# EAGLE design ESP32-S3 Parallel TFT with Touch 4.3“ V1.3 (EAGLE 6.1)
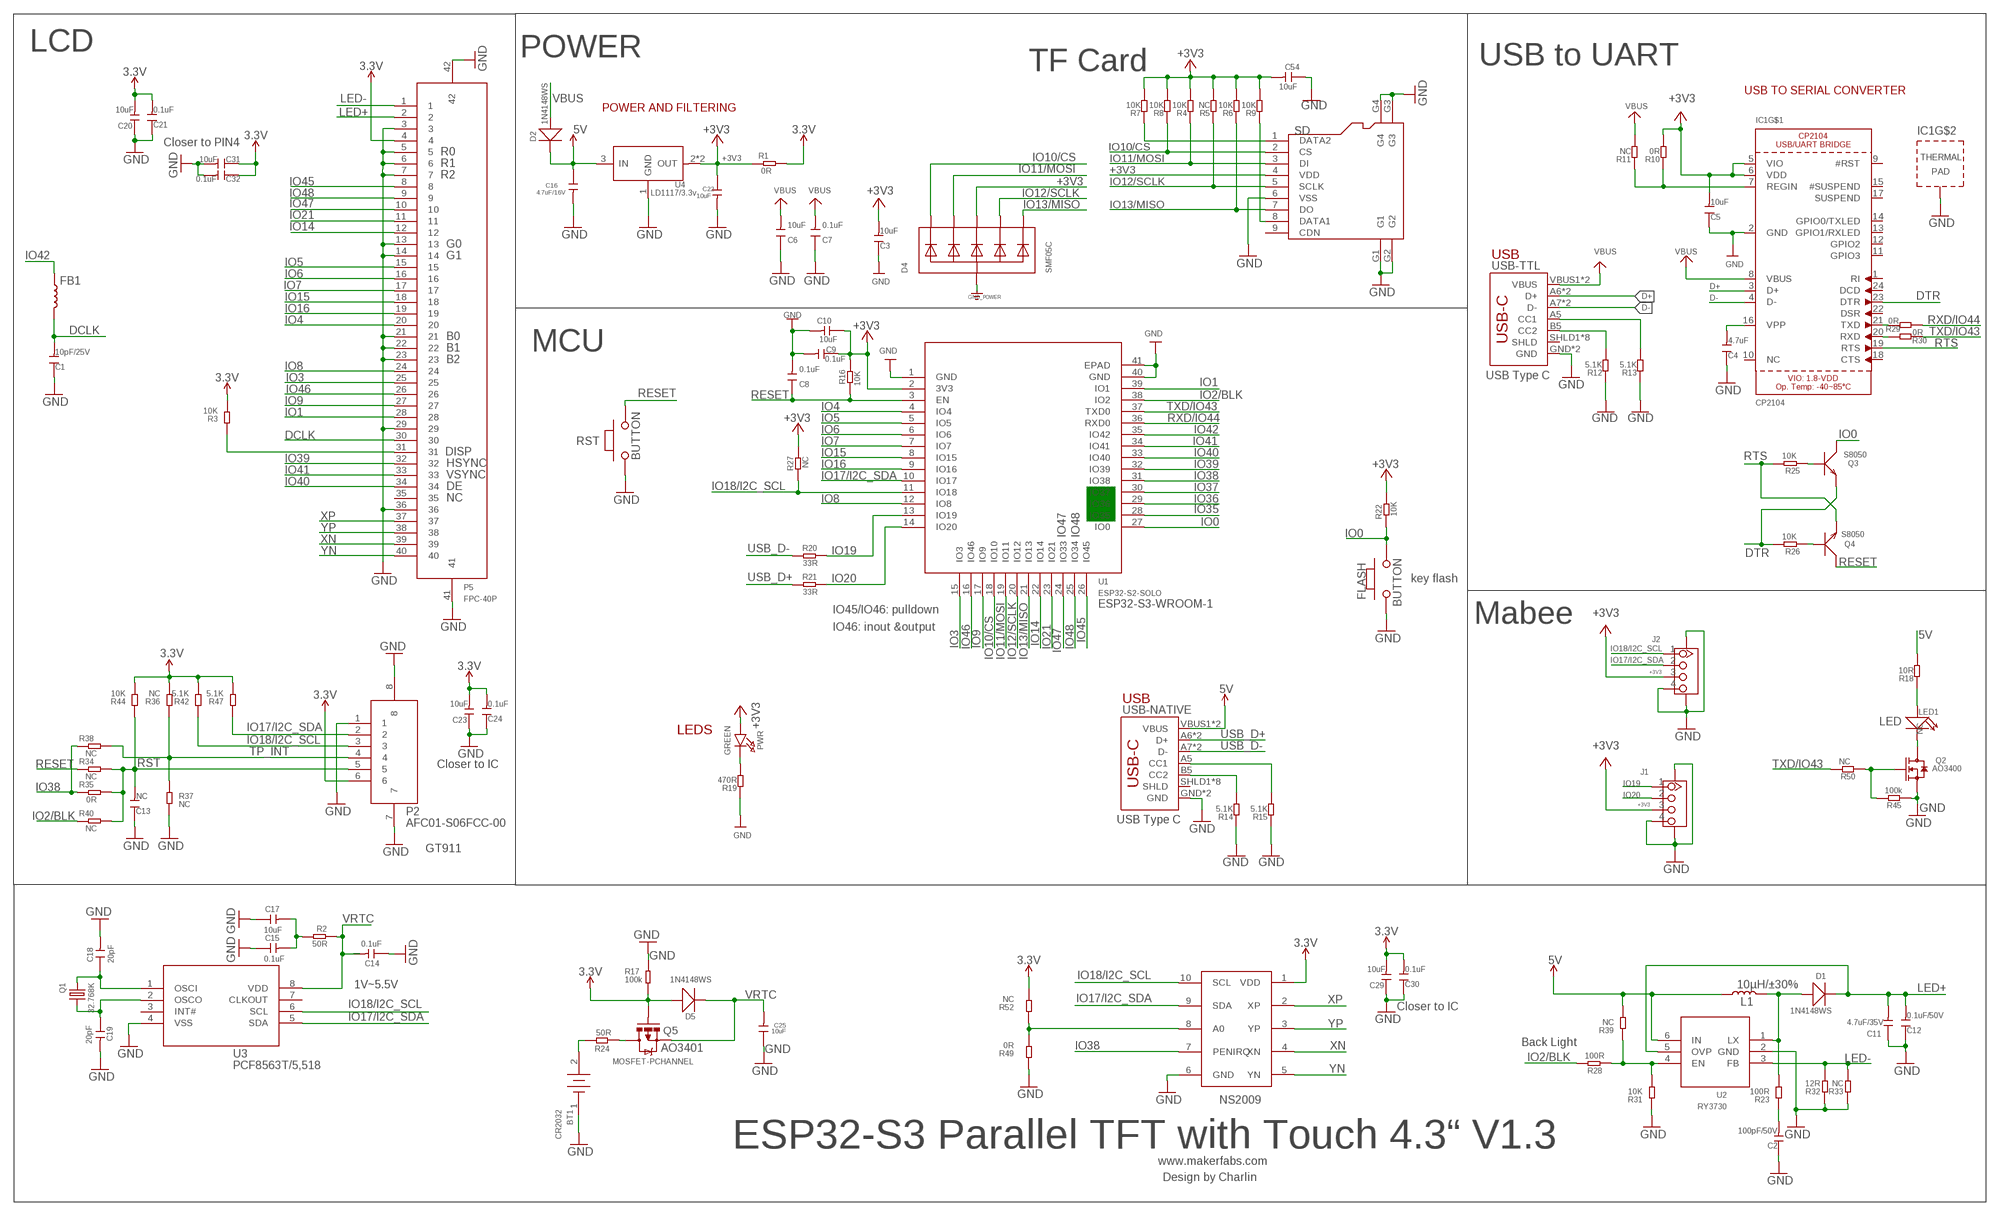
[diagram p0: schematic, sheet 1]

## Parts
BT1  CR2032  [CR2032]
C1  10pF/25V  DISCRETE_C-0603  [DISCRETE_C0603]
C2  100pF/50V  DISCRETE_C-0603  [DISCRETE_C0603]
C3  10uF  DISCRETE_C-0603  [DISCRETE_C0603]
C4  4.7uF  DISCRETE_C-0603  [DISCRETE_C0603]
C5  10uF  DISCRETE_C-0603  [DISCRETE_C0603]
C6  10uF  DISCRETE_C-0603  [DISCRETE_C0603]
C7  0.1uF  DISCRETE_C-0603  [DISCRETE_C0603]
C8  0.1uF  DISCRETE_C-0603  [DISCRETE_C0603]
C9  0.1uF  DISCRETE_C-0603  [DISCRETE_C0603]
C10  10uF  DISCRETE_C-0603  [DISCRETE_C0603]
C11  4.7uF/35V  DISCRETE_C-1206  [DISCRETE_C1206]
C12  0.1uF/50V  DISCRETE_C-0603  [DISCRETE_C0603]
C13  NC  DISCRETE_C-0603  [DISCRETE_C0603]
C14  0.1uF  DISCRETE_C-0603  [DISCRETE_C0603]
C15  0.1uF  DISCRETE_C-0603  [DISCRETE_C0603]
C16  4.7uF/16V  C-0603  [0603]
C17  10uF  DISCRETE_C-0603  [DISCRETE_C0603]
C18  20pF  DISCRETE_C-0603  [DISCRETE_C0603]
C19  20pF  DISCRETE_C-0603  [DISCRETE_C0603]
C20  10uF  DISCRETE_C-0603  [DISCRETE_C0603]
C21  0.1uF  DISCRETE_C-0603  [DISCRETE_C0603]
C22  10uF  C-0603  [0603]
C23  10uF  DISCRETE_C-0603  [DISCRETE_C0603]
C24  0.1uF  DISCRETE_C-0603  [DISCRETE_C0603]
C25  10uF  C-0603  [0603]
C29  10uF  DISCRETE_C-0603  [DISCRETE_C0603]
C30  0.1uF  DISCRETE_C-0603  [DISCRETE_C0603]
C31  10uF  DISCRETE_C-0603  [DISCRETE_C0603]
C32  0.1uF  DISCRETE_C-0603  [DISCRETE_C0603]
C54  10uF  DISCRETE_C-0603  [DISCRETE_C0603]
D1  1N4148WS  D'0805'  [SOD323]
D2  1N4148WS  D'0805'  [SOD323]
D4  SMF05C  TVSARRAY_5LANE  [SOT363]
D5  1N4148WS  D'0805'  [SOD323]
FB1  INDUCTORFB-30OHM  [0603]
FLASH  BUTTON  PB157  [157SW]
IC1  CP2104  [QFN24_4MM_SMSC]
J1  GROVE-CONNECTOR-SMD'90D'  [HW4-SMD-2.0-90D]
J2  GROVE-CONNECTOR-SMD'90D'  [HW4-SMD-2.0-90D]
L1  10µH/±30%  INDUCTOR-CR54-3.3UH  [CR54]
LED1  NC  DISCRETE_LED3528  [DISCRETE_LED-3528]
P2  AFC01-S06FCC-00  [SMD8-50P-740L535W]
P5  FPC-40P  [SMD42-50P-2560L490W]
PWR  GREEN  LED0805_NOOUTLINE  [CHIPLED_0805_NOOUTLINE]
Q1  32.768K  CRYSTAL_3215  [XTAL3215]
Q2  AO3400  MOSFET-N'SOT23'  [SOT23@1]
Q3  S8050  TRANSISTOR-NPN-SOT23  [SOT23]
Q4  S8050  TRANSISTOR-NPN-SOT23  [SOT23]
Q5  MOSFET-PCHANNEL  [SOT23-3]
R1  0R  R-0603  [R0603]
R2  50R  R-0603  [R0603]
R3  10K  DISCRETE_R-0603  [DISCRETE_R0603]
R4  10K  DISCRETE_R-0603  [DISCRETE_R0603]
R5  NC  DISCRETE_R-0603  [DISCRETE_R0603]
R6  10K  DISCRETE_R-0603  [DISCRETE_R0603]
R7  10K  DISCRETE_R-0603  [DISCRETE_R0603]
R8  10K  DISCRETE_R-0603  [DISCRETE_R0603]
R9  10K  DISCRETE_R-0603  [DISCRETE_R0603]
R10  0R  DISCRETE_R-0603  [DISCRETE_R0603]
R11  NC  DISCRETE_R-0603  [DISCRETE_R0603]
R12  5.1K  DISCRETE_R-0603  [DISCRETE_R0603]
R13  5.1K  DISCRETE_R-0603  [DISCRETE_R0603]
R14  5.1K  DISCRETE_R-0603  [DISCRETE_R0603]
R15  5.1K  DISCRETE_R-0603  [DISCRETE_R0603]
R16  10K  R-0603  [R0603]
R17  100k  R-0603  [R0603]
R18  10R  DISCRETE_R-0603  [DISCRETE_R0603]
R19  470R  DISCRETE_R-0603  [DISCRETE_R0603]
R20  33R  R-0603  [R0603]
R21  33R  R-0603  [R0603]
R22  10K  R-0603  [R0603]
R23  100R  DISCRETE_R-0603  [DISCRETE_R0603]
R24  50R  R-0603  [R0603]
R25  10K  R-0603  [R0603]
R26  10K  R-0603  [R0603]
R27  NC  R-0603  [R0603]
R28  100R  DISCRETE_R-0603  [DISCRETE_R0603]
R29  0R  R-0603  [R0603]
R30  0R  R-0603  [R0603]
R31  10K  DISCRETE_R-0603  [DISCRETE_R0603]
R32  12R  DISCRETE_R-0603  [DISCRETE_R0603]
R33  NC  DISCRETE_R-0603  [DISCRETE_R0603]
R34  NC  R-0603  [R0603]
R35  0R  R-0603  [R0603]
R36  NC  DISCRETE_R-0603  [DISCRETE_R0603]
R37  NC  DISCRETE_R-0603  [DISCRETE_R0603]
R38  NC  R-0603  [R0603]
R39  NC  DISCRETE_R-0603  [DISCRETE_R0603]
R40  NC  R-0603  [R0603]
R42  5.1K  DISCRETE_R-0603  [DISCRETE_R0603]
R44  10K  DISCRETE_R-0603  [DISCRETE_R0603]
R45  100k  R-0603  [R0603]
R47  5.1K  DISCRETE_R-0603  [DISCRETE_R0603]
R49  0R  DISCRETE_R-0603  [DISCRETE_R0603]
R50  NC  R-0603  [R0603]
R52  NC  DISCRETE_R-0603  [DISCRETE_R0603]
RST  BUTTON  PB157  [157SW]
SD  HOLDER-MICROSD-9P  [9P-SMD-W/-RING]
U1  ESP32­S2­SOLO  [ESP32-­S2-­SOLO]
U2  RY3730  [SOT23-6]
U3  PCF8563T/5,518  [SOP8]
U4  LD1117/3.3v  LD1117'SOT89'  [SOT89]
U8  NS2009  [MSOP10]
USB-NATIVE  USB_C5  [USB-C-16P-5]
USB-TTL  USB_C5  [USB-C-16P-5]

## Nets
3.3V: C20.2 C21.2 C23.2 C24.2 C29.2 C30.2 C31.1 C32.1 D5.+ P2.6 P5.4 Q5.1(G) R1.2 R3.2 R17.1 R36.2 R42.2 R44.2 R47.2 R52.2 U8.1(VDD)
5V: C16.1 D2.- L1.P$1 R18.2 R39.2 U2.6(IN) U4.3(IN) USB-NATIVE.VBUS1(VBUS) USB-NATIVE.VBUS2(VBUS)
+3V3: C3.2 C5.2 C9.1 C10.1 C22.1 C54.2 D4.4(C3) IC1.5(VIO) IC1.6(VDD) J1.3 J2.3 PWR.A R1.1 R4.2 R5.2 R6.2 R7.2 R8.2 R9.2 R10.2 R16.2 R22.2 R27.2 SD.4(VDD) U1.2(3V3) U4.2(OUT) U4.4(OUT)
D+: IC1.3(D+) USB-TTL.A6(D+) USB-TTL.B6(D+)
D-: IC1.4(D-) USB-TTL.A7(D-) USB-TTL.B7(D-)
DCLK: C1.2 FB1.2 P5.30
DTR: IC1.23(DTR) Q3.2(E) R26.2
GND: BT1.1 C1.1 C2.1 C3.1 C4.1 C5.1 C6.1 C7.1 C8.2 C9.2 C10.2 C11.1 C12.1 C13.1 C14.1 C15.1 C16.2 C17.1 C18.2 C19.2 C20.1 C21.1 C22.2 C23.1 C24.1 C25.1 C29.1 C30.1 C31.2 C32.2 C54.1 D4.2(A) FLASH.1 IC1.2(GND) IC1.THERM(TP) J1.4 J1.SS1 J1.SS2 J2.4 J2.SS1 J2.SS2 P2.1 P2.7 P2.8 P5.3 P5.5 P5.6 P5.7 P5.13 P5.14 P5.21 P5.22 P5.23 P5.29 P5.36 P5.41 P5.42 Q2.2(S) R12.1 R13.1 R14.1 R15.1 R17.2 R19.1 R31.1 R32.1 R33.1 R37.2 R45.1 R49.1 RST.1 SD.6(VSS) SD.G1 SD.G2 SD.G3 SD.G4 U1.1(GND) U1.40(GND) U1.41(EPAD) U2.2(GND) U3.4(VSS) U4.1(GND) U8.6(GND) USB-NATIVE.GND USB-NATIVE.GND2(GND) USB-TTL.GND USB-TTL.GND2(GND) ; supply symbol labelled GND_POWER
IO0: FLASH.2 Q3.3(C) R22.1 U1.27(IO0)
IO1: P5.28 U1.39(IO1)
IO2/BLK: R28.2 R40.1 U1.38(IO2)
IO3: P5.25 U1.15(IO3)
IO4: P5.20 U1.4(IO4)
IO5: P5.15 U1.5(IO5)
IO6: P5.16 U1.6(IO6)
IO7: P5.17 U1.7(IO7)
IO8: P5.24 U1.12(IO8)
IO9: P5.27 U1.17(IO9)
IO10/CS: D4.1(C1) R8.1 SD.2(CS) U1.18(IO10)
IO11/MOSI: D4.3(C2) R4.1 SD.3(DI) U1.19(IO11)
IO12/SCLK: D4.5(C4) R5.1 SD.5(SCLK) U1.20(IO12)
IO13/MISO: D4.6(C5) R6.1 SD.7(DO) U1.21(IO13)
IO14: P5.12 U1.22(IO14)
IO15: P5.18 U1.8(IO15)
IO16: P5.19 U1.9(IO16)
IO17/I2C_SDA: J2.2 P2.2 R47.1 U1.10(IO17) U3.5(SDA) U8.9(SDA)
IO18/I2C_SCL: J2.1 P2.3 R27.1 R42.1 U1.11(IO18) U3.6(SCL) U8.10(SCL)
IO19: J1.1 R20.2 U1.13(IO19)
IO20: J1.2 R21.2 U1.14(IO20)
IO21: P5.11 U1.23(IO21)
IO35: U1.28(IO35)
IO36: U1.29(IO36)
IO37: U1.30(IO37)
IO38: R35.1 R38.1 U1.31(IO38) U8.7(PENIRQ)
IO39: P5.32 U1.32(IO39)
IO40: P5.34 U1.33(IO40)
IO41: P5.33 U1.34(IO41)
IO42: FB1.1 U1.35(IO42)
IO45: P5.8 U1.26(IO45)
IO46: P5.26 U1.16(IO46)
IO47: P5.10 U1.24(IO33)
IO48: P5.9 U1.25(IO34)
LED+: C11.2 C12.2 D1.- P5.2 U2.5(OVP)
LED-: P5.1 R32.2 R33.2 U2.3(FB)
N$1: C4.2 IC1.16(VPP)
N$2: Q4.1(B) R26.1
N$3: Q3.1(B) R25.1
N$4: C18.1 Q1.P$1 U3.1(OSCI)
N$5: Q2.1(G) R45.2 R50.1
N$6: R15.2 USB-NATIVE.A5(CC1)
N$7: PWR.C R19.2
N$8: LED1.1(+) R18.1
N$9: LED1.2(-) Q2.3(D)
N$10: R13.2 USB-TTL.A5(CC1)
N$11: R12.2 USB-TTL.B5(CC2)
N$12: IC1.7(REGIN) R10.1 R11.1
N$13: C19.1 Q1.P$2 U3.2(OSCO)
N$14: R14.2 USB-NATIVE.B5(CC2)
N$15: Q5.3(D) R24.1
N$16: C15.2 C17.2 R2.1
N$17: D1.+ L1.P$2 R23.2 U2.1(LX)
N$18: IC1.21(TXD) R29.2
N$19: IC1.20(RXD) R30.2
N$20: BT1.2 R24.2
N$22: C2.2 R23.1
N$24: R28.1 R31.2 R39.1 U2.4(EN)
N$25: R49.2 R52.1 U8.8(A0)
N$28: P5.31 R3.1
N$47: R7.1 SD.1(DATA2)
N$48: R9.1 SD.8(DATA1)
RESET: C8.1 Q4.3(C) R16.1 R34.1 RST.2 U1.3(EN)
RST: C13.2 P2.5 R34.2 R35.2 R40.2 R44.1
RTS: IC1.19(RTS) Q4.2(E) R25.2
RXD/IO44: R29.1 U1.36(RXD0)
TP_INT: P2.4 R36.1 R37.1 R38.2
TXD/IO43: R30.1 R50.2 U1.37(TXD0)
USB_D+: R21.1 USB-NATIVE.A6(D+) USB-NATIVE.B6(D+)
USB_D-: R20.1 USB-NATIVE.A7(D-) USB-NATIVE.B7(D-)
VBUS: C6.2 C7.2 D2.+ IC1.8(VBUS) R11.2 USB-TTL.VBUS1(VBUS) USB-TTL.VBUS2(VBUS)
VRTC: C14.2 C25.2 D5.- Q5.2(S) R2.2 U3.8(VDD)
XN: P5.39 U8.4(XN)
XP: P5.37 U8.2(XP)
YN: P5.40 U8.5(YN)
YP: P5.38 U8.3(YP)
Unconnected: IC1.1(RI) IC1.9(#RST) IC1.10(NC) IC1.11(GPIO3) IC1.12(GPIO2) IC1.13(GPIO1/RXLED) IC1.14(GPIO0/TXLED) IC1.15(#SUSPEND) IC1.17(SUSPEND) IC1.18(CTS) IC1.22(DSR) IC1.24(DCD) P5.35 SD.9(CDN) U3.3(INT#) U3.7(CLKOUT) USB-NATIVE.SHLD1(SHLD) USB-NATIVE.SHLD2(SHLD) USB-NATIVE.SHLD3(SHLD) USB-NATIVE.SHLD4(SHLD) USB-NATIVE.SHLD5(SHLD) USB-NATIVE.SHLD6(SHLD) USB-NATIVE.SHLD7(SHLD) USB-NATIVE.SHLD8(SHLD) USB-TTL.SHLD1(SHLD) USB-TTL.SHLD2(SHLD) USB-TTL.SHLD3(SHLD) USB-TTL.SHLD4(SHLD) USB-TTL.SHLD5(SHLD) USB-TTL.SHLD6(SHLD) USB-TTL.SHLD7(SHLD) USB-TTL.SHLD8(SHLD)

## Notes on the sheet
- LCD | POWER
- TF Card | USB to UART
- USB TO SERIAL CONVERTER
- POWER AND FILTERING
- Closer to PIN4
- R0
- R1
- R2
- G0
- G1 | USB
- B0
- B1 | MCU
- B2
- USB Type C
- DISP
- HSYNC
- VSYNC
- DE
- NC
- IO47 | IO48
- key flash
- ESP32-S3-WROOM-1
- IO45/IO46: pulldown
- Mabee
- IO46: inout &output
- USB
- LED
- LEDS
- Closer to IC
- USB Type C
- GT911
- 1V~5.5V
- Closer to IC
- Back Light
- AO3401
- NS2009
- ESP32-S3 Parallel TFT with Touch 4.3“ V1.3
- www.makerfabs.com
- Design by Charlin

## Library data of the parts
BT1 = sale:CR2032
C1-C15 C17-C21 C23 C24 C29-C32 C54 = A9G:DISCRETE_C*: Ceramic Capacitors
C16 C22 C25 = Discrete:C*: Ceramic Capacitors
D1 D2 D5 = Discrete:D*
D4 = microbuilder:TVSARRAY_5LANE: Voltage Transient Suppressor Array SOT363 SMF05C - 100W 5V: Digikey - SMF05CT1GOSCT-ND
FB1 = SparkFun-Coils:INDUCTOR: Inductors Resist changes in electrical current. Basically a coil of wire. SparkFun Products: SparkFun Load Cell Amplifier - HX711 <https://www.sparkfun.com/products/13879> IOIO-OTG - V2.2 <https://www.sparkfun.com/products/13613>; PROD_ID: NDUC-07859
FLASH RST = MySMD:PB157
IC1 = microbuilder:CP2104: CP2104 - USB to UART Bridge VDD Output: 3.45V
J1 J2 = Connector-new:GROVE-CONNECTOR-SMD: 4P-SMD-2.0:320110030;4P-SMD-2.0-90D:320110032
L1 = SparkFun-Coils:INDUCTOR: Inductors Resist changes in electrical current. Basically a coil of wire. SparkFun Products: SparkFun Load Cell Amplifier - HX711 <https://www.sparkfun.com/products/13879> IOIO-OTG - V2.2 <https://www.sparkfun.com/products/13613>; PROD_ID: NDUC-11157; VALUE: 3.3µH/±30%/3.4A
LED1 = Relay:DISCRETE_LED*
P2 = self:AFC01-S06FCC-00
P5 = self:FPC-40P
PWR = microbuilder:LED: LED 0603 - 0603 Surface Mount Package 2mA: Green LED - Low Power (3.9mcd, 2ma, 1.7Vf) - Digikey: 475-2709-2-ND Orange LED - Low Power (9.8mcd, 2ma, 1.8Vf) - Digikey: 475-1194-2-ND Red LED - Low Power (5mcd, 2ma, 1.8Vf) - Digikey: 475-1195-2-ND Yellow LED - Low Power (7mcd, 2ma, 1.8Vf) - Digikey: 475-1196-2-ND 5mA: Blue LED - Low Power (17mcd, 5ma, 2.9Vf) - Digikey: LNJ937W8CRACT-ND 0805 - 0805 Surface Mount Package 2mA: Red LED (8.8mcd, 2mA, 1.8Vf, Clear) - Low Power [Digikey: 475-2510-1-ND] Green LED (5mcd, 2mA, 1.8Vf, Clear) - Low Power [Digikey: 475-2730-1-ND] Yellow LED (11.3mcd, 2mA, 1.8Vf, Clear) - Low Power [Digikey: 475-2555-1-ND] 20mA: Red LED (104mcd, 20mA, Diffused) - LS R976 [Digikey: 475-1278-6-ND] Red LED (12mcd, 20mA, 2.0Vf, Clear) - APT2012EC [Digikey: 754-1128-1-ND] Green LED (15mcd, 20mA, 2.2Vf, Clear) - APT2012GC [Digikey: 754-1131-1-ND] Orange LED (160mcd, 20mA, 2.1Vf, Clear) - APT2012SECK [Digikey: 754-1130-1-ND] 1206 - 1206 Surface Mount Package Green LED (26mcd, 20mA, Diffused) - LG N971 [Digikey: 475-1407-6-ND] Red LED (15mcd, 20mA, Diffused) - LH N974 [Digikey: 475-1416-6-ND] Cree - Cree High-Power Surface Mount LEDs XPEBWT-L1-0000-00D50 - White 111lm 350mA 2.9Vf 6200K 110° XTEAWT-00-0000-00000LEE3 - White 114lm 350mA 2.85Vf 5000K 115° Everlight - Everlight 45-21 Series Surface Mount LEDs 45-21/QK2C-B2832AC2CB2/2T - Warm White 2000mcd 20mA 3.25Vf 3050K 120° 45-21/LK2C-B38452C4CB2/2T - Nuetral White 2000mcd 20mA 3.25Vf 4150K 120° 45-21/LK2C-B50634C6CB2/2T - Cold White 2200mcd 20mA 3.25Vf 5650K 120° PLCC2 Reverse Mount LS T77K-J1L2-1-0-2-R18-Z - Red 11.25mcd 2mA 1.8Vf 630nm 120° LO T77K-L1M2-24-Z - Orange 19.6mcd 2mA 1.8Vf 606nm 120° LY T77K-K2M1-26-Z - Yellow 15.7mcd 2mA 1.8Vf 587nm 120°
Q1 = microbuilder:CRYSTAL: Crystals HC49UP - Surface Mount Crystal 4.0MHz 18pF +/-30ppm Surface Mount Crystal [Digikey: 535-9857-1-ND] 12.0 MHz Surface Mount Crystal [Digikey: 535-9869-6-ND] 25.0 MHz Surface Mount Crystal [Digikey: 535-9078-1-ND] 2.5 x 2.0mm - MEMs SMT Crystal 16.0 MHz 10pF 20ppm 2.5 x 2.0mm Crystal [Digikey -40-85°C: 535-10923-1-ND] 3.2 x 2.5mm - MEMs SMT Crystal 12.0 MHz 8pF 15ppm 3.2 x 2.5mm Crystal [Digikey: -10-70°C: 644-1047-1-ND -40-125°C: 644-1128-1-ND] 40~85°C cheaper: 644-1173-6-ND 16.0 MHz 8pF 15ppm 3.2 x 2.5mm Crystal [Digikey: -10-70°C: 644-1049-1-ND -40-125°C: 644-1129-2-ND]-40~85°C cheaper: 644-1175-6-ND 16.0 MHz 10pF 10ppm 3.2 x 2.5mm Crystal [Digikey: 644-1100-1-ND] 27.12 MHz 18pF 30ppm 3.2 x 2.5mm Crystal [Digikey: 887-1424-1-ND] 27.12MHz 10pF 10ppm 3.2 x 2.5mm Crystal [Digikey: 887-1329-1-ND] 4.9 x 1.8mm - MEMs SMT Crystal 32.768 KHz 12.5pF 20ppm 4.9 x 1.8mm Crystal [Digikey: SE2415CT-ND] 8.0 x 3.8mm - Surface Mount Crystal 32.768kHz 12.5pF 20ppm -40°C-85°C [Digikey: 535-9166-2-ND] Cylinder 32.768KHz Cylinder Crystal (2x6mm body) [Ex. Digikey: 300-8341-2-ND]
Q2 = Discrete:MOSFET-N: IRLL014: http://www.vishay.com/docs/91319/sihll014.pdf
Q3 Q4 = Discrete:TRANSISTOR-NPN*: NPN audion
Q5 = User-Submitted:MOSFET-PCHANNEL: Generic PMOSFET IRLML2244 - TRANS-11153 (SOT-23 -20V -4.3A) (1.Gate 2.Source 3.Drain) FQP27P06 - COM-10349 <http://www.sparkfun.com/products/10349> (TO-220 -60V -27A) (1.Gate 2.Source 3.Drain); PROD_ID: TRANS-08285
R1 R2 R16 R17 R20-R22 R24-R27 R29 R30 R34 R35 R38 R40 R45 R50 = Discrete:R*
R3-R15 R18 R19 R23 R28 R31-R33 R36 R37 R39 R42 R44 R47 R49 R52 = A9G:DISCRETE_R*
SD = Connector:HOLDER-MICROSD-9P
U1 = self:ESP32­S2­SOLO
U2 = sale:RY3730
U3 = sale:PCF8563T/5,518
U4 = IC:LD1117: Low Drop Fixed And Adjustable Positive Voltage Regulators http://www.datasheetcatalog.org/datasheet/SGSThomsonMicroelectronics/mXuqtqv.pdf
U8 = NS2009:NS2009
USB-NATIVE USB-TTL = USBC:USB_C: USB Type C 16Pin Connector Super Speed pins not available on the 16-pin purely SMD connector so this part is best for USB 2.0 implementations. D1 and D2 are tied together enabling D+/- no matter which way the cable is plugged into the connector. The two channel configuration pins (CC1/2) are exposed. These are normally connected to ground via 5.1k resistors but can be reconfigured for high current/high power applications.

## Net classes
0 default: width 0.203 mm, drill 0.305 mm, clearance 0.152 mm
1 vbat: width 0.254 mm, drill 0.305 mm, clearance 0.152 mm

## Board
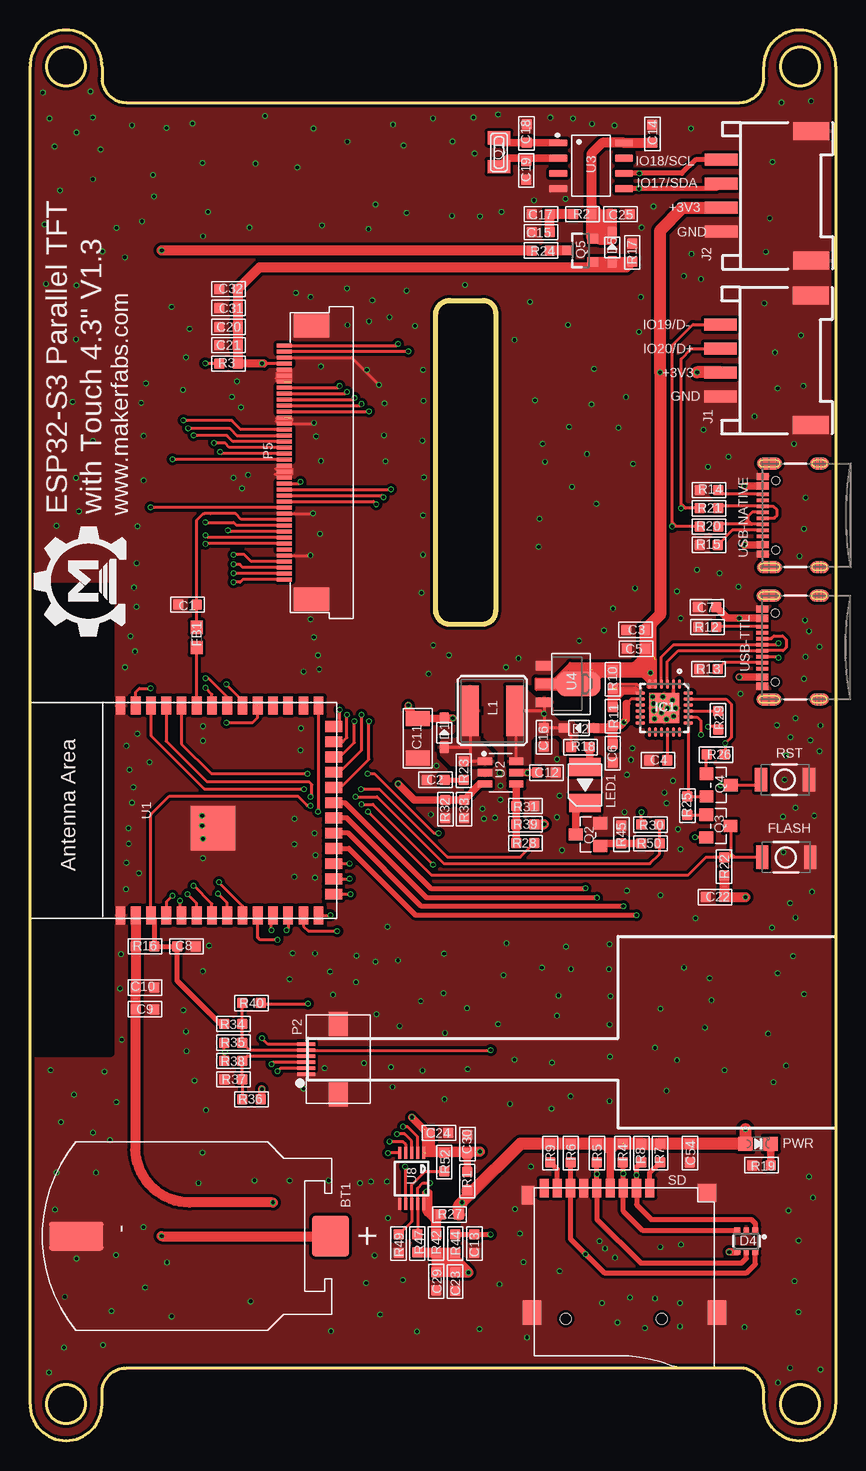
[diagram p1: board, top side]
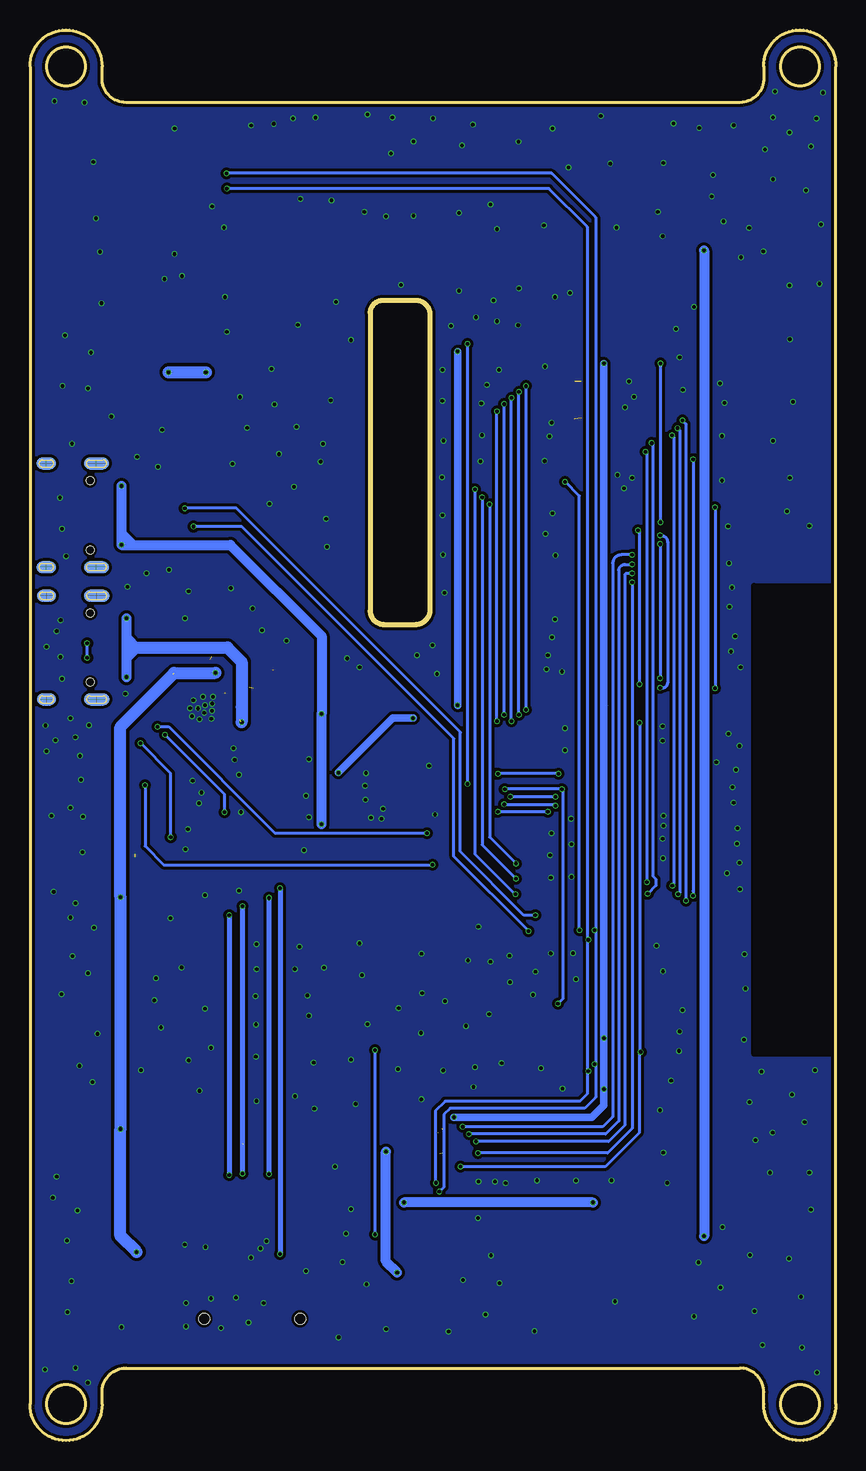
[diagram p2: board, bottom side, seen from below]

Size 67.15 x 117.6 mm. Coordinates in mm from the lower left corner, seen from the top.
Outline: 61.15,3.05 61.15,4.05 arc90 59.15,6.05 8,6.05 arc90 6,4.05 6,3.05 arc-182 0,3.05 0,114.55 arc-182 6,114.55 6,113.55 arc90 8,111.55 59.15,111.55 arc90 61.15,113.55 61.15,114.55 arc-182 67.15,114.55 67.15,3.05 arc-182 61.15,3.05
Outline: 38.81,94.01 38.81,69.18 arc-90 37.67,68.05 35,68.05 arc-90 33.81,69.24 33.81,93.87 arc-90 34.98,95.05 37.77,95.05 arc-90 38.81,94.01
Outline: circle at 3,114.55 radius 1.6
Outline: circle at 3,3.05 radius 1.6
Outline: circle at 64.15,3.05 radius 1.6
Outline: circle at 64.15,114.55 radius 1.6
Copper layers (1*16): Top 0.035mm / dielectric 1.5mm / Bottom 0.035mm
Design rules: minimum track width 6mil, minimum drill 10mil, track to track 6mil, track to pad 6mil, pad to pad 6mil, via to via 6mil, smd to smd 0mil, copper to edge 10mil, drill to drill 10mil, minimum pad ring 3mil, minimum via ring 3mil, stop-mask expansion 2mil, vias tented up to drill 100mil, thermal gap 0mil
tRestrict: area 0,32.2 to 6.8,71.2
bRestrict: area 0,32.2 to 6.8,71.2

### Footprints (pad centres in the part's own frame; a part is rotated, then mirrored left to right if it is on the bottom)
CR2032 = smd 4.5 x 2.4: 1 -10.95,0 | smd 3.05 x 3.4: 2 10.225,0
DISCRETE_C0603 = smd 0.889 x 0.889: 1 -0.762,0; 2 0.762,0
DISCRETE_C1206 = smd 1.27 x 2.032: 1 -1.651,0; 2 1.651,0
0603 = smd 0.889 x 0.889: 1 -0.762,0; 2 0.762,0
SOD323 = smd 1 x 0.8: + -1.2,0; - 1.2,0
SOT363 = smd 0.5 x 0.5: 1 -0.75,-0.9; 3 0.75,-0.9; 4 0.75,0.9; 6 -0.75,0.9 | smd 0.4 x 0.5: 2 0,-0.9; 5 0,0.9
0603' = smd 1.1 x 1: 1 -0.85,0; 2 0.85,0
157SW = smd 1.016 x 1.981: 1 0,0; 2 4,0
QFN24_4MM_SMSC = smd 0.8 x 0.28: 1 -2,1.25; 2 -2,0.75; 3 -2,0.25; 4 -2,-0.25; 5 -2,-0.75; 6 -2,-1.25; 13 2,-1.25; 14 2,-0.75; 15 2,-0.25; 16 2,0.25; 17 2,0.75; 18 2,1.25 | smd 0.28 x 0.8: 7 -1.25,-2; 8 -0.75,-2; 9 -0.25,-2; 10 0.25,-2; 11 0.75,-2; 12 1.25,-2; 19 1.25,2; 20 0.75,2; 21 0.25,2; 22 -0.25,2; 23 -0.75,2; 24 -1.25,2 | smd 2.5 x 2.5: THERM 0,0
HW4-SMD-2.0-90D = smd 1.01 x 2.74: 1 -3,-0.1; 2 -1,-0.1; 3 1,-0.1; 4 3,-0.1 | smd 1.5 x 3: SS1 -5.4,7.4; SS2 5.4,7.4
CR54 = smd 4.2 x 1.4: P$1 0,1.85; P$2 0,-1.85
DISCRETE_LED-3528 = smd 1.5 x 2.6: 1 -1.5,0; 2 1.5,0
SMD8-50P-740L535W = smd 0.3 x 1.5: 1 -1.25,0; 2 -0.75,0; 3 -0.25,0; 4 0.25,0; 5 0.75,0; 6 1.25,0 | smd 2 x 1.6: 7 2.95,-2.68; 8 -2.95,-2.68
SMD42-50P-2560L490W = smd 0.3 x 1.3: 1 9.75,0; 2 9.25,0; 3 8.75,0; 4 8.25,0; 5 7.75,0; 6 7.25,0; 7 6.75,0; 8 6.25,0; 9 5.75,0; 10 5.25,0; 11 4.75,0; 12 4.25,0; 13 3.75,0; 14 3.25,0; 15 2.75,0; 16 2.25,0; 17 1.75,0; 18 1.25,0; 19 0.75,0; 20 0.25,0; 21 -0.25,0; 22 -0.75,0; 23 -1.25,0; 24 -1.75,0; 25 -2.25,0; 26 -2.75,0; 27 -3.25,0; 28 -3.75,0; 29 -4.25,0; 30 -4.75,0; 31 -5.25,0; 32 -5.75,0; 33 -6.25,0; 34 -6.75,0; 35 -7.25,0; 36 -7.75,0; 37 -8.25,0; 38 -8.75,0; 39 -9.25,0; 40 -9.75,0 | smd 2 x 3: 41 -11.4,-2.25; 42 11.4,-2.25
CHIPLED_0805_NOOUTLINE = smd 1.2 x 1.2: A 0,-1.05; C 0,1.05
XTAL3215 = smd 1.1 x 1.9: P$1 1.2,0; P$2 -1.2,0
SOT23@1 = smd 1.016 x 1.143: 1 -0.95,-1.016; 2 0.95,-1.016; 3 0,1.016
SOT23 = smd 1.016 x 1.143: 1 -0.95,-1.016; 2 0.95,-1.016; 3 0,1.016
SOT23-3 = smd 0.8 x 0.9: 1 -0.95,-1; 2 0.95,-1; 3 0,1.1
R0603 = smd 0.889 x 0.889: 1 -0.762,0; 2 0.762,0
DISCRETE_R0603 = smd 0.889 x 0.889: 1 -0.762,0; 2 0.762,0
9P-SMD-W/-RING = smd 1.524 x 0.762: 1 0,4.4; 2 0,3.3; 3 0,2.2; 4 0,1.1; 5 0,0; 6 0,-1.1; 7 0,-2.2; 8 0,-3.3; 9 0,-4.4 | smd 1.524 x 1.016: G1 0.6,-5.746 | smd 2.032 x 1.524: G2 10.373,-5.4; G3 10.373,10 | smd 1.524 x 1.524: G4 0.392,9.181 | hole 0.889: 10.9,-2.6; 10.9,5.4
ESP32-­S2-­SOLO = smd 1.5 x 0.9: 1 -8.75,5.26; 2 -8.75,3.99; 3 -8.75,2.72; 4 -8.75,1.45; 5 -8.75,0.18; 6 -8.75,-1.09; 7 -8.75,-2.36; 8 -8.75,-3.63; 9 -8.75,-4.9; 10 -8.75,-6.17; 11 -8.75,-7.44; 12 -8.75,-8.71; 13 -8.75,-9.98; 14 -8.75,-11.25; 27 8.75,-11.25; 28 8.75,-9.98; 29 8.75,-8.71; 30 8.75,-7.44; 31 8.75,-6.17; 32 8.75,-4.9; 33 8.75,-3.63; 34 8.75,-2.36; 35 8.75,-1.09; 36 8.75,0.18; 37 8.75,1.45; 38 8.75,2.72; 39 8.75,3.99; 40 8.75,5.26 | smd 0.9 x 1.5: 15 -6.985,-12.5; 16 -5.715,-12.5; 17 -4.445,-12.5; 18 -3.175,-12.5; 19 -1.905,-12.5; 20 -0.635,-12.5; 21 0.635,-12.5; 22 1.905,-12.5; 23 3.175,-12.5; 24 4.445,-12.5; 25 5.715,-12.5; 26 6.985,-12.5 | smd 3.7 x 3.7: 41 -1.5,-2.46
SOT23-6 = smd 1.2 x 0.6: 1 -1.3,0.95; 2 -1.3,0; 3 -1.3,-0.95; 4 1.3,-0.95; 5 1.3,0; 6 1.3,0.95
SOP8 = smd 1.52 x 0.6: 1 -2.74,1.905; 2 -2.74,0.635; 3 -2.74,-0.635; 4 -2.74,-1.905; 5 2.74,-1.905; 6 2.74,-0.635; 7 2.74,0.635; 8 2.74,1.905
SOT89 = smd 0.8 x 1.4: 1 -1.524,-1.905; 3 1.524,-1.905 | smd 0.8 x 1.9: 2 0,-1.651 | smd 2.032 x 3.65: 4 0,0.94
MSOP10 = smd 0.25 x 1: 1 -1,-2.113; 2 -0.5,-2.113; 3 0,-2.113; 4 0.5,-2.113; 5 1,-2.113; 6 1,2.113; 7 0.5,2.113; 8 0,2.113; 9 -0.5,2.113; 10 -1,2.113
USB-C-16P-5 = smd 0.3 x 1: A5 -1.25,-0.34; A6 -0.25,-0.34; A7 0.25,-0.34; A8 1.25,-0.34; B5 1.75,-0.34; B6 0.75,-0.34; B7 -0.75,-0.34; B8 -1.75,-0.34 | smd 0.6 x 1: GND -3.225,-0.34; GND2 3.225,-0.34; VBUS1 -2.45,-0.34; VBUS2 2.45,-0.34 | smd 1 x 2.1: SHLD1 -4.32,-0.915; SHLD2 4.32,-0.915 | smd 1 x 2.1 bottom: SHLD3 -4.32,-0.915; SHLD4 4.32,-0.915 | smd 1 x 1.6: SHLD5 -4.32,-5.095; SHLD8 4.32,-5.095 | smd 1 x 1.6 bottom: SHLD6 -4.32,-5.095; SHLD7 4.32,-5.095 | hole 0.65: -2.89,-1.445; 2.89,-1.445

### Placement (x,y rotation side)
BT1  14.81,17.05 0 top
C1  13.13,69.7 0 top
C2  33.81,55.1 0 top
C3  50.47,67.59 0 top
C4  52.35,56.72 0 top
C5  50.5,66.02 0 top
C6  48.56,57.31 90 top
C7  56.41,69.47 0 top
C8  13.03,41.2 0 top
C9  9.58,35.97 0 top
C10  9.58,37.77 0 top
C11  32.31,58.55 90 top
C12  43.05,55.68 180 top
C13  37.03,16.44 90 top
C14  51.87,108.94 270 top
C15  42.57,100.74 0 top
C16  42.83,58.65 270 top
C17  42.57,102.24 0 top
C18  41.38,108.97 90 top
C19  41.35,105.9 270 top
C20  16.53,92.84 0 top
C21  16.54,91.32 0 top
C22  57.08,45.31 180 top
C23  35.42,13.26 90 top
C24  34.09,25.66 180 top
C25  49.23,102.24 180 top
C29  33.86,13.28 90 top
C30  36.45,24.73 270 top
C31  16.54,94.42 180 top
C32  16.54,95.98 180 top
C54  55,23.98 90 top
D1  34.52,59.01 90 top
D2  45.75,59.41 180 top
D4  59.7,16.64 180 top
D5  48.51,99.47 90 top
FB1  [0603']  13.89,66.96 90 top
FLASH  65.02,48.63 180 top
IC1  52.86,61.08 270 top
J1  57.65,90.05 270 top
J2  57.7,103.78 270 top
L1  38.53,60.86 270 top
LED1  46.25,54.66 270 top
P2  23,31.8 90 top
P5  21.2,81.55 90 top
PWR  60.67,24.74 270 top
Q1  39.09,107.39 90 top
Q2  46.5,50.53 90 top
Q3  57.37,51.24 270 top
Q4  57.38,54.64 270 top
Q5  45.9,99.22 90 top
R1  36.44,21.65 90 top
R2  46.02,102.24 0 top
R3  16.54,89.79 0 top
R4  49.38,23.98 90 top
R5  47.24,23.98 90 top
R6  45.06,23.98 90 top
R7  52.5,23.98 90 top
R8  50.95,23.98 90 top
R9  43.36,23.98 90 top
R10  48.56,63.48 90 top
R11  48.56,60.38 270 top
R12  56.44,67.82 0 top
R13  56.54,64.32 0 top
R14  56.59,79.25 0 top
R15  56.57,74.68 0 top
R16  9.58,41.2 180 top
R17  50.19,99.04 90 top
R18  45.87,57.81 180 top
R19  60.96,22.96 0 top
R20  56.59,76.2 180 top
R21  56.59,77.73 180 top
R22  57.84,47.86 270 top
R23  36.14,55.86 90 top
R24  42.57,99.22 180 top
R25  54.79,52.93 90 top
R26  57.15,57.19 0 top
R27  34.98,18.85 0 top
R28  41.27,49.81 0 top
R29  57.34,60.06 90 top
R30  51.72,51.35 180 top
R31  41.27,52.91 180 top
R32  34.62,52.66 90 top
R33  36.17,52.66 90 top
R34  16.94,34.75 0 top
R35  16.94,33.18 0 top
R36  18.47,28.45 0 top
R37  16.94,30.13 180 top
R38  16.94,31.65 0 top
R39  41.27,51.39 0 top
R40  18.47,36.48 180 top
R42  33.84,16.44 270 top
R44  35.44,16.44 270 top
R45  49.28,50.53 270 top
R47  32.28,16.45 270 top
R49  30.71,16.42 90 top
R50  51.72,49.79 0 top
R52  34.52,23.22 90 top
RST  64.92,55.1 180 top
SD  47.24,21.06 270 top
U1  12.8,52.55 90 top
U2  39.22,55.68 0 top
U3  46.76,106.28 0 top
U4  44.77,63.08 270 top
U8  31.79,21.86 180 top
U$1  [MAKERFABS_0.3]  7.94,67.52 90 top
USB-NATIVE  60.7,77.14 90 top
USB-TTL  60.68,66.11 90 top

### Tracks (layer width: path | path; a pad name or v marks a point on that pad's centre or on a via)
3.3V  (via drill 0.3)  (3 unrouted)
  Top 0.254: 32.79,25.89 32.84,25.94 | R52.2 | U8.1 32.79,25.99 | P5.4 v19.34,89.8 | v19.34,89.8 v19.33,89.79 R3.2 | 17.42,90.35 17.75,90.02 19.38,90.02 | 19.38,90.02 19.56,90.02 19.79,89.79 19.56,89.56 17.6,89.56 | v19.34,89.8 19.34,89.98 19.38,90.02 | P2.6 19.83,33.05 v19.33,33.55
  Top 0.61: C24.2 33.12,25.66 v31.83,26.95 | R1.2 C30.2 R52.2 | R52.2 | R52.2 32.99,23.97 32.99,25.61 33.07,25.68 33.15,25.68 33.45,25.38 33.45,24.54 33.81,24.18 36.65,24.18 | R36.2 19.33,28.55 v19.33,29.31
  Top 0.813: R47.2 R42.2 | R42.2 33.84,14.07 C29.2 33.89,14.02 C23.2 v36.55,14.02 | R44.2 R42.2 | v37.49,24.08 36.56,24.08 C30.2 | 35.43,15.6 35.43,15.14 v36.55,14.02 | v36.55,14.02 35.74,14.02 34.54,15.22 34.54,14.3 | Q5.1 D5.+ R17.1 49.71,97.79 19.11,97.79 C32.1 C31.1 C20.2 C21.2 R3.2
  Bottom 0.61: v19.33,89.79 v19.33,33.55 19.33,30.41 v19.33,29.31 19.33,27.94 20.32,26.95 v31.83,26.95
  Bottom 0.813: v36.55,14.02 37.49,14.96 v37.49,24.08
5V  (via drill 0.3)
  Top 0.254: 59.55,79.59 v59.54,79.58 | 61.03,74.68 USB-NATIVE.VBUS1 | R18.2 45.11,58.85 D2.- C16.1 42.85,59.43 v42.85,60.58 | U4.3 42.86,60.59 v42.85,60.58 | v42.85,60.58 42.57,60.86 L1.P$1 40.52,60.73 U2.6
  Top 0.61: USB-NATIVE.VBUS2 59.55,79.59 | v59.54,74.68 61.03,74.68
  Top 0.813: R39.2 v42.85,51.39
  Bottom 0.61: 58.4,74.63 59.54,75.77
  Bottom 0.813: v59.54,79.58 59.54,75.77 v59.54,74.68 50.44,74.68 42.85,67.08 v42.85,60.58 v42.85,51.39
  pour Top: 39.88,56.37 39.88,62.84 41.12,62.84 41.99,61.98 43.54,61.98 43.54,60.51 44.12,59.92 45.21,59.92 45.57,59.57 45.57,57.43 44.48,57.43 44.48,58.45 44.07,58.85 42.11,58.85 41.63,58.37 41.63,56.49 41.63,56.37
+3V3  (via drill 0.3)  (4 unrouted)
  Top 0.254: 57.54,89.06 J1.3 | IC1.5 IC1.6 51.61,63.93 v51.7,64.01 | 52.12,62.79 51.51,62.79 51.51,63.22 51.05,63.68 47.6,63.68 46.53,62.61 42.19,62.61 42.19,63.48 42.16,63.5 43.71,63.5 45.01,64.8 50.27,64.8 51.08,65.61 51.64,65.61 52.12,65.13 52.12,62.97 51.74,62.97 51.92,63.15 51.92,65.05 51.71,65.26 51.71,63.25 | 51.71,63.22 51.71,63.25 | 51.71,63.25 50.7,64.27 50.7,65.08 50.49,64.87 50.49,64.65 45.11,64.65 44.55,64.09 46.1,64.09 46.51,64.49 45.14,64.49 44.93,64.29 46.86,64.29 47.37,63.78 48.18,63.78 48.21,63.81 | 52.09,64.6 52.12,64.62 52.12,67.9 | 52.12,68.08 52.12,67.9 | 52.12,67.9 51.87,67.64 51.87,65.51 52.02,65.36
  Top 0.406: v58.28,15.74 v58.27,15.73
  Top 0.61: SD.4 48.34,24.66 48.26,24.74 | D4.4 v58.28,15.74 | 47.75,24.67 48.34,24.08 49.05,24.79 49.45,24.79
  Top 0.813: R22.2 C22.1 v59.61,45.31 v59.61,45.32 | U1.2 R16.2 C10.1 C9.1 8.79,35.94 8.79,24.36 arc90 13.29,19.86 v20.24,19.86 | U4.2 U4.4 46.86,64.24 R10.2
  Top 1.016: 57.54,89.06 v55.6,89.06 | J2.3 54.41,102.77 52.5,100.86 v52.5,89.06 52.5,68.86 C3.2 51.26,67.57 C5.2 51.26,64.45 v51.7,64.01 51.47,64.24 R10.2 | v59.61,25.99 PWR.A C54.2 R7.2 R8.2 R4.2 48.26,24.74 R5.2 R6.2 R9.2 40.88,24.74 36.69,20.56 | 36.69,20.56 v35.99,19.86 35.74,19.6 R27.2 | R1.1 36.44,20.81 36.69,20.56
  Bottom 0.305: 59.61,30.43
  Bottom 0.813: v20.24,19.86 v35.99,19.86
  Bottom 1.016: 55.19,63.91 59.61,59.49 v59.61,45.32 59.61,30.43 v59.61,25.99 59.61,17.07 v58.27,15.73 | 55.14,64.01 v51.7,64.01 | v55.6,89.06 v52.5,89.06
D+
  Top 0.254: USB-TTL.B6 61.78,66.86 62,67.08 62.71,67.08 63.02,66.78 63.02,66.12 62.76,65.87 USB-TTL.A6 54.02,65.86 53.11,64.95 IC1.3
D-  (via drill 0.3)
  Top 0.254: USB-TTL.B7 62.27,65.36 v62.38,65.26 | v62.38,66.48 62.28,66.37 61.03,66.37 USB-TTL.A7 53.63,66.36 52.61,65.34 IC1.4
  Bottom 0.254: v62.38,65.26 v62.38,66.48
DCLK
  Top 0.254: P5.30 17.62,76.8 17.14,77.27 15.06,77.27 14.53,77.27 14.43,77.27 13.89,76.74 C1.2 FB1.2
DTR  (via drill 0.3)
  Top 0.254: IC1.23 58.02,61.83 58.42,61.42 58.42,58.63 v57.94,58.14 57.94,57.21 R26.2 | Q3.2 55.43,50.29 v55.42,50.3
  Bottom 0.254: v55.42,50.3 55.42,55.63 v57.94,58.14
GND  (via drill 0.3)  (2 unrouted)
  Top 0.254: IC1.2 53.61,61.8 v53.54,61.73 | P5.3 26.8,90.3 v29.08,88.01 | P5.14 23.61,84.8 v23.67,84.86 | P5.29 v23.59,77.3 v23.6,77.3 | P5.36 v23.36,73.8 v23.37,73.79 | 20.62,89.28 21.74,89.28 21.74,88.29 20.62,88.29 20.62,89.03 21.69,89.03 21.69,88.55 20.5,88.55 | 20.55,85.22 21.79,85.22 21.79,84.99 20.5,84.99 | 20.47,81.03 21.79,81.03 21.79,80.55 20.4,80.55
  other vias: 62.23,59.64 51.89,62 52.73,62 53.8,61.06 53.64,60.38 52.55,61.29 51.97,61.45 51.99,60.84 52.04,60.18 52.63,60.68 53.04,60.15 53.14,61.04 62.89,55.1 63.37,58.63 14.43,58.35 56.79,36.71 63.7,13.31 49.99,11.94 54.15,11.48 48.95,9.86 47.68,11.48 51.23,9.38 65.89,5.92 14.43,59.54 64.06,16.69 62.33,4.83 63.78,60.23 62.99,57.08 62.74,52.02 62.79,49.05 65.35,52.1 65.02,58.4 64.59,68.41 64.62,65.33 64.49,63.5 54.23,68.56 53.92,70.82 57.45,72.29 45.16,79.5 42.39,74.5 46.79,86.39 14.83,102.44 49.05,84.43 29.97,93.65 24.33,101.3 28.78,103.05 31.39,95.86 42.47,76.84 39.29,102.44 44.93,84.51 46.41,82.25 56.13,84.25 58.22,82.02 64.64,78.62 64.49,76.03 64.14,73.74 63.65,83.11 62.31,87.73 62.08,90.71 61.19,94.82 64.24,92.13 64.44,87.91 60.38,85.37 54.48,97.08 55.93,96.83 47.02,89.36 55.12,98.91 61.65,101.91 61.87,106.61 61.32,99.11 62.61,111.53 65.1,111.66 55.09,109.4 1.63,110.21 1.22,101.4 3.86,109.05 48.72,109.63 5.05,112.47 1.07,112.37 2.06,107.88 8.51,109.65 13.54,109.81 2.49,104.22 5.89,107.65 7.21,101.09 3.84,91.82 3.56,86.59 13,90.3 3.84,80.27 26.47,92.99 18.29,101.12 18.8,106.45 22.28,106.12 31.39,102.34 10.24,105.51 11.38,109.43 9.35,101.65 44.83,93.02 36.25,96.35 28.52,95.05 35.18,102.11 32.08,92.94 29.49,83.82 42.72,83.09 23.85,83.72 24.26,81.66 28.24,93.32 22.15,95.68 16.81,87.02 17.65,79.38 23.65,66.98 44.04,37.11 42.65,39.42 48.29,28.32 30.2,29.49 52.55,36.02 48.26,39.3 56.64,38.56 64.92,22 32.26,9.1 54.51,39.45 63.6,40.39 63.35,44.81 63.02,31.24 53.92,31.7 52.53,16.16 48.34,32.01 61.95,29.9 57.89,30.89 39.47,38.81 45.09,39.32 62.31,38.97 59.54,9.45 2.9,11.99 11.81,10.37 32.56,36.63 28.78,39.93 2.82,7.75 6.1,7.98 11.43,14.86 3.89,15.17 14.66,27.54 13.72,30.03 9.45,17.81 36.42,36.05 48.74,15.24 8.2,51.06 9.07,47.3 8.51,53.19 14.4,48.57 8.03,48.19 7.59,40.54 8,45.98 8.23,49.76 7.16,15.47 2.21,22.35 6.78,10.8 32.72,30.86 14.35,52.1 9.6,12.75 8.94,58.93 8.86,69.52 8.03,57.91 14.35,51.26 8.89,73.15 2.21,76.25 8.66,71.12 7.92,64.47 9.47,83.75 39.7,41.46 48.31,34.7 52.07,32.74 44.68,41.18 52.07,11.86 22.78,29.34 47.93,16.03 36.47,30.97 23.75,40.62 21.89,40.64 8.31,55.93 44.15,14.13 48.29,41.38 25.1,9.12 56.24,34.45 64.52,37.21 63.78,52.76 65.18,45.75 65.79,57.48 65.86,59.62 37.47,9.3 63.78,43.61 49.66,87 23.39,68.48 9.65,88.14 22.56,57.56 24.1,64.29 9.96,56.57 48.36,37.06 42.93,81.61 26.42,96.04 26.44,108.28 5.23,110.32 5.23,105.16 6.05,99.14 30.25,109.71 64.03,10.72 39.01,34.72 34.47,37.32 34.57,33.99 34.52,40.59 34.54,28.45 30.07,31.14 30.81,34.57 54.25,16.34 27.15,38.23 23.7,50.63 23.75,46.94 13,34.12 14.38,24.01 18.39,11.61 6.68,25.05 3.66,28.83 2.59,26.55 5.26,25.68 1.57,5.67 63.35,6.07 29.18,10.52 52.55,45.47 61.82,42.78 61.52,33.91 47.45,16.64 27.84,31.47 43.92,35.41 24,65.48 54.15,9.53 63.2,19.18 65.79,66.17 64.92,67.49 59.21,62.26 37.49,102.06 16.97,80.27 9.47,80.04 18.19,80.5 17.58,86.13 12.75,87.58 3.86,96.29 9.27,86.52 4.06,77.47 19.58,110.42 28.22,100.99 23.39,95.33 14.43,50.17 14.94,41.25 8.61,54.46 12.78,35.89 7.65,33.43 7.52,37.7 7.19,28.22 14.05,21.49 24.56,31.04 22.02,46.99 23.8,48.8 41.73,22.84 25.02,39.09 28.4,21.59 10.34,103.71 1.35,96.45 42.09,86.72 5.23,83.34 8.38,67.06 5.49,22.33 2.08,19.26 22.58,59.39 22.81,64.11 33.88,56.26 33.4,52.2 39.19,53.42 37.72,52.68 44.15,53.75 43.92,51.97 43.92,56.8 40.72,65.2 34.9,65.48 33.22,63.91 50.42,71.07 47.83,67.57 48.59,69.37 59.03,71.17 55.58,72.6 41.66,94.92 44.63,103.51 42.01,103.41 46.84,109.78 43.36,110.29 45.24,110.21 39.01,110.54 33.58,110.24 35.2,108.31 36.96,110.32 37.06,107.32 31.14,107.98 23.62,109.4 14.38,106.51 11.81,94.52 14.43,100.41 13.31,92.69 7.9,98.66 17.25,88.29 24.23,89.54 28.07,89.26 32.69,83.37 32.77,89.26 32.77,77.14 32.61,70.69 33.6,66.3 40.39,91.75 39.67,64.47 45.77,66.68 49.73,55.5 50.19,57.71 53.06,53.14 53.59,55.02 54.2,49.3 54,50.98 49.56,52.4 44.32,49.23 50.09,56.75 38.73,51.92 52.86,54.03 37.85,51.84 29.79,42.85 30.66,40.03 27.2,40.44 25.25,37.16 28.88,35.56 40.82,17.27 65.25,20.25 53.04,29.16 45.06,28.7 40.01,28.07 43.46,27.69 43.51,31.5 40.39,31.75 14.4,39.12 13.06,32.49 1.73,30.89 6.2,30.76 8.74,65.79 8.97,76.23 24.18,75.59 32.74,73.87 32.82,80.29 32.79,86.69 29.54,86.46 29.62,81.64 51.97,102.9 50.98,101.12 50.9,95.33 50.75,92.43 50.27,81.44 47.19,78.08 56.49,81.18 18.69,21.69 21.64,21.67 24.89,21.69 27.51,21.47 29.77,21.59 29.82,18.54 28.73,15.45 31.06,13.39 28.02,13.13 39.12,13.03 40.41,19.31 41.12,14.89 41.43,8.61 49.73,45.85 55.45,43.56 39.14,55.65 39.22,54.59 22.02,49.71 22.05,51.84 21.64,38.46
  pour Top (isolate 0.254, rank 6): -7,126.05 -7,-13.95 75,-13.95 75,126.05
  pour Bottom (isolate 0.254, rank 6): -6,-13.95 75,-13.95 75,126.05 -6,126.05
IO0  (via drill 0.3)  (1 unrouted)
  Top 0.254: FLASH.2 58.34,48.63 | 58.34,48.63 R22.1 56.32,48.63 54.86,47.17 33.43,47.17 v28.17,52.43 | U1.27 24,61.25 v24,52.43 | Q3.3 58.38,48.67 58.34,48.63 | 58.4,49.08 58.4,48.92 58.67,48.64
  Bottom 0.254: v24,52.43 v28.17,52.43
IO1  (via drill 0.3)
  Top 0.254: P5.28 v10.06,77.8 | U1.39 8.81,62.41 9.12,62.72 v10.06,62.72
  Bottom 0.254: v10.06,77.8 v10.06,62.72
IO2/BLK  (via drill 0.3)
  Top 0.254: U1.38 10.08,58.78 14.53,54.33 22.82,54.33 v22.84,54.32 | v27.58,54.32 29.1,54.32 34.77,48.64 40.87,48.64 R28.2 | R40.1 19.28,36.43 v23.16,36.43
  Bottom 0.254: v27.58,54.32 v22.84,54.32 22.73,54.22 22.73,36.86 v23.16,36.43
IO3  (via drill 0.3)
  Top 0.254: U1.15 26.68,45.56 v26.7,45.55 | P5.25 v30.07,79.3
  Bottom 0.254: v30.07,79.3 30.07,48.92 v26.7,45.55
IO4  (via drill 0.3)
  Top 0.254: P5.20 v11.89,81.8 | U1.4 11.38,43.83 11.38,44.94 v11.89,45.44
  Bottom 0.254: v11.89,81.8 11.89,45.83 11.89,45.82 v11.89,45.44
IO5  (via drill 0.3)
  Top 0.254: P5.15 17.56,84.3 16.82,85.04 v12.78,85.04 | v12.5,45.03 12.5,43.92 U1.5
  Bottom 0.254: v12.78,85.04 12.5,84.76 v12.5,45.03
IO6  (via drill 0.3)
  Top 0.254: v13.18,84.41 16.64,84.41 17.25,83.8 P5.16 | U1.6 13.89,44.79 v13.13,45.55
  Bottom 0.254: v13.18,84.41 13.01,84.23 13.01,45.68 v13.13,45.55
IO7  (via drill 0.3)
  Top 0.254: P5.17 16.91,83.3 16.41,83.8 v13.64,83.8 | U1.7 15.16,44.74 v13.63,46.28
  Bottom 0.254: v13.64,83.8 13.51,83.67 13.51,46.39 v13.63,46.28
IO8  (via drill 0.3)
  Top 0.254: P5.24 22.42,79.8 v22.55,79.94 | U1.12 21.51,42.7 v21.36,42.55
  Bottom 0.254: v21.36,42.55 21.36,78.74 v22.55,79.94
IO9  (via drill 0.3)
  Top 0.254: U1.17 v26.64,48.1 v26.64,48.11 | P5.27 28.6,78.3 v28.85,78.05
  Bottom 0.254: v28.85,78.05 28.85,50.32 v26.64,48.11
IO10/CS  (via drill 0.3)
  Top 0.406: U1.18 26.58,49.37 32.15,43.8 v50.55,43.8 | D4.1 60.45,18.11 60.12,18.44 51.77,18.44 50.54,19.67 SD.2 v50.54,22.15 v50.55,22.15 50.55,22.81 R8.1
  Bottom 0.406: v50.55,43.8 v50.55,22.15
IO11/MOSI  (via drill 0.3)
  Top 0.254: 49.43,21.04 SD.3
  Top 0.406: U1.19 26.52,50.64 32.62,44.55 v49.44,44.55 | D4.3 51.02,17.54 49.45,19.1 49.45,21.05 SD.3 v49.44,22.25 49.44,23.15 R4.1
  Bottom 0.406: v49.44,44.55 v49.44,22.25
IO12/SCLK  (via drill 0.3)
  Top 0.406: U1.20 26.41,51.91 33.08,45.25 v47.24,45.25 | D4.5 59.7,15.2 59.31,14.81 50.88,14.81 47.24,18.44 SD.5 v47.24,22.23 R5.1
  Bottom 0.406: v47.24,45.25 v47.24,22.23
IO13/MISO  (via drill 0.3)
  Top 0.254: SD.7
  Top 0.406: U1.21 26.25,53.18 33.38,46.05 v46.3,46.05 | D4.6 60.45,14.7 59.74,14 47.85,14 v46.3,15.55 45.06,16.79 45.06,21.04 SD.7 45.06,21.08 R6.1
  Bottom 0.406: v46.3,46.05 v46.3,15.55
IO14  (via drill 0.3)
  Top 0.254: U1.22 25.9,54.45 28.25,56.8 v28.25,59.97 | P5.12 v28.25,85.8
  Bottom 0.254: v28.25,59.97 v28.25,85.8
IO15  (via drill 0.3)
  Top 0.254: P5.18 16.62,82.8 16.26,83.16 v15.34,83.16 | U1.8 16.43,44.83 v15.67,45.59
  Bottom 0.254: v15.34,83.16 15.24,83.06 15.24,47.07 14.99,46.82 14.99,46.28 v15.67,45.59
IO16  (via drill 0.3)
  Top 0.254: P5.19 15.98,82.3 v15.85,82.43 | U1.9 17.7,44.59 v15.75,46.55
  Bottom 0.254: v15.75,46.55 15.75,82.32 v15.85,82.43
IO17/I2C_SDA  (via drill 0.3)
  Top 0.254: v33.33,21.49 32.74,21.49 32.29,21.04 U8.9 32.29,17.22 R47.1 | v20.62,41.75 19.16,41.75 18.97,41.94 U1.10 | P2.2 20.86,31.05 v20.62,30.81
  Top 0.406: J2.2 57.19,104.37 v50.75,104.37 U3.5
  Bottom 0.254: 20.73,41.74 20.73,101.2 23.9,104.37 v50.75,104.37 | 20.73,41.74 20.73,30.79 | v20.62,41.75 20.71,41.75 20.73,41.74 | v20.62,30.81 20.7,30.81 20.73,30.79 | 20.73,30.79 20.73,28.91 21.34,28.3 32.56,28.3 33.33,27.54 v33.33,21.49
IO18/I2C_SCL  (via drill 0.3)
  Top 0.254: 32.79,20.55 U8.10 32.79,20.73 32.92,20.86 | 32.92,20.86 33.3,20.86 33.38,20.78 33.38,19.36 33.15,19.13 | v20.12,42.55 20.12,44.22 20.02,44.33 20.02,44.02 U1.11 | P2.3 20.27,31.55 v20.12,31.4 | 33.07,20.73 v33.05,20.76 33.02,20.76 32.92,20.86
  Top 0.406: 33.07,20.73 33.07,19.64 33.6,19.1 34.44,19.1 | J2.1 55.47,106.78 54.33,105.64 v50.77,105.64 U3.6
  Top 0.813: R42.1 33.84,18.48 R27.1 33.43,18.85 | 33.43,18.85 33.15,19.13 33.07,19.21 | 33.43,18.85 33.83,18.44 33.83,17.28
  Bottom 0.254: 20.02,42.55 20.02,101.98 23.67,105.64 v50.77,105.64 | 20.02,42.55 20.02,31.4 | v20.12,42.55 20.02,42.55 | 20.02,42.55 | v20.12,31.4 20.02,31.4 | 20.02,31.4 20.02,28.63 20.93,27.71 32.13,27.71 32.66,27.18 32.66,21.14 v33.05,20.76
IO19  (via drill 0.3)
  Top 0.254: 53.52,76.58 v53.52,76.2 53.9,76.2 | 53.52,76.58 53.52,91.32 55.24,93.04 J1.1 | R20.2 53.9,76.2 | 53.52,76.58 53.9,76.2 | U1.13 22.78,42.88 23.19,42.47 v25.6,42.47
  Bottom 0.254: v53.52,76.2 49.51,76.2 31.83,58.52 31.83,48.7 v25.6,42.47
IO20  (via drill 0.3)
  Top 0.254: 54.25,78.11 v54.25,77.73 54.63,77.73 | 54.25,78.11 54.25,90.17 55.12,91.04 57.54,91.04 J1.2 | R21.2 54.63,77.73 | 54.25,78.11 54.63,77.73 | U1.14 v25.04,43.79
  Bottom 0.254: v54.25,77.73 49.96,77.73 31.29,59.06 | v25.04,43.79 25.98,43.79 31.29,49.1 31.29,59.06 | 31.27,59.03 31.29,59.06
IO21  (via drill 0.3)
  Top 0.254: U1.23 25.8,55.72 27.64,57.56 v27.64,60.51 | P5.11 27.52,86.3 v27.64,86.41
  Bottom 0.254: v27.64,60.51 v27.64,86.41
IO38  (via drill 0.3)  (1 unrouted)
  Top 0.254: U8.7 31.29,22.81 v31.27,22.84 | v16.36,59.85 18.55,59.85 18.97,60.28 U1.31 | R38.1 16.18,32.36 | 16.18,32.36 R35.1 | v16.26,32.4 16.22,32.4 16.18,32.36
  Bottom 0.254: v16.36,59.85 16.36,32.3 | v31.27,22.84 19.23,22.84 16.36,25.71 16.36,32.3 | 16.36,32.3 v16.26,32.4
IO39  (via drill 0.3)
  Top 0.254: P5.32 16.59,75.8 v16.48,75.9 | U1.32 17.7,61.7 v16.36,63.05
  Bottom 0.254: v16.36,63.05 16.36,75.77 v16.48,75.9
IO40  (via drill 0.3)
  Top 0.254: P5.34 14.68,74.8 v14.63,74.75 | U1.33 16.43,62.01 14.89,63.55 v14.63,63.55
  Bottom 0.254: v14.63,74.75 v14.63,63.55
IO41  (via drill 0.3)
  Top 0.254: P5.33 14.8,75.3 v14.63,75.47 | U1.34 15.16,62.22 v14.63,62.75
  Bottom 0.254: v14.63,75.47 14.58,75.47 arc90 14.02,74.91 14.02,63.17 arc90 14.45,62.75 v14.63,62.75
IO42
  Top 0.254: U1.35 FB1.1
IO45  (via drill 0.3)
  Top 0.254: U1.26 25.52,59.53 25.81,59.82 v25.81,60.94 | P5.8 25.69,87.8 v25.81,87.91
  Bottom 0.254: v25.81,60.94 v25.81,87.91
IO46  (via drill 0.3)
  Top 0.254: U1.16 v26.64,46.83 v26.64,46.84 | P5.26 29.31,78.8 v29.46,78.65
  Bottom 0.254: v29.46,78.65 29.46,49.66 v26.64,46.84
IO47  (via drill 0.3)
  Top 0.254: U1.24 25.82,56.99 27.03,58.19 v27.03,59.97 | P5.10 26.9,86.8 v27.03,86.92
  Bottom 0.254: v27.03,59.97 v27.03,86.92
IO48  (via drill 0.3)
  Top 0.254: U1.25 26.08,58.26 26.42,58.6 v26.42,60.51 | P5.9 26.28,87.3 v26.42,87.43
  Bottom 0.254: v26.42,60.51 v26.42,87.43
LED+  (via drill 0.3)
  Top 0.254: v31.52,90.8 P5.2
  Top 0.406: 34.54,60.23 D1.-
  Top 0.61: C12.2 v41.45,55.68 U2.5 | v31.52,61.29 31.52,60.99 C11.2 D1.- | 34.54,60.23 v35.23,60.23
  Bottom 0.61: v31.52,61.29 v31.52,90.8 | v35.23,60.23 36.91,60.23 v41.45,55.68
LED-  (via drill 0.3)
  Top 0.254: P5.1 30.54,91.3 v30.68,91.44
  Top 0.61: U2.3 37.48,54.73 R33.2 R32.2 32.01,53.42 v30.68,54.75
  Bottom 0.254: v30.68,54.75 v30.68,91.44
N$1
  Top 0.254: IC1.16 C4.2
N$2
  Top 0.254: Q4.1 56.37,57.17 R26.1
N$3
  Top 0.254: R25.1 56.34,52.17 Q3.1
N$4
  Top 0.61: U3.1 41.55,108.18 | 41.55,108.18 39.5,108.18 Q1.P$1 | C18.1 41.53,108.21 41.55,108.18
N$5
  Top 0.61: Q2.1 47.71,49.77 R45.2 49.3,49.79 R50.1
N$6
  Top 0.254: USB-NATIVE.A5 58.54,75.89 R15.2
N$7
  Top 0.61: PWR.C R19.2
N$8
  Top 0.61: R18.1 46.63,56.54 LED1.1
N$9
  Top 0.61: LED1.2 45.49,52.39 Q2.3
N$10
  Top 0.254: USB-TTL.A5 57.85,64.86 R13.2
N$11
  Top 0.254: USB-TTL.B5 57.24,67.86 R12.2
N$12  (2 unrouted)
  Top 0.254: IC1.7 48.78,62.33 48.56,62.11 | 48.54,61.52 48.69,61.52 49.51,62.33 50.9,62.33 50.9,62.74 50.62,63.02 48.9,63.02 48.9,62.79 50.52,62.79 50.75,62.56 48.95,62.56 48.95,62.03 49.17,62.26
  Top 0.813: R11.1 R10.1
N$13
  Top 0.61: U3.2 41.25,106.91 | 41.25,106.91 39.81,106.91 Q1.P$2 | C19.1 41.35,106.81 41.25,106.91
N$14
  Top 0.254: USB-NATIVE.B5 57.71,78.89 R14.2
N$15
  Top 0.813: Q5.3 R24.1
N$16
  Top 0.813: R2.1 C17.2 C15.2
N$17
  Top 0.254: U2.1 36.65,56.63 | 36.65,56.63 36.15,56.63 R23.2 | L1.P$2 36.68,57.76 | 36.68,57.76 36.68,56.66 36.65,56.63 | D1.+ 36.64,57.81 36.68,57.76
  pour Top: 38.56,56.34 35.1,56.34 34.11,57.33 34.11,58.25 34.34,58.47 35.51,58.47 35.86,58.83 35.86,62.92 37.39,62.92 37.39,58.37 38.53,57.23 38.56,57.2
N$18
  Top 0.254: IC1.21 R29.2
N$19  (via drill 0.3)
  Top 0.254: IC1.20 55.6,60.33 55.91,60.02 v55.91,58.86 | R30.2 v50.95,52.38
  Bottom 0.254: v55.91,58.86 50.95,53.9 v50.95,52.38
N$20  (via drill 0.3)
  Top 0.813: R24.2 v10.97,99.22 | v10.97,17.05 BT1.2
  Bottom 0.813: v10.97,99.22 v10.97,17.05
N$22
  Top 0.406: C2.2 R23.1
N$24
  Top 0.61: U2.4 R31.2 R39.1 R28.1
N$25
  Top 0.254: R52.1 32.92,22.46 31.79,21.33 U8.8 31.79,18.26 R49.2
N$28  (via drill 0.3)
  Top 0.254: P5.31 17.23,76.3 16.98,76.55 v14.61,76.55 | R3.1 v14.61,89.79
  Bottom 0.254: v14.61,76.55 v14.61,89.79
N$47
  Top 0.406: SD.1 51.64,22.36 R7.1
N$48
  Top 0.406: SD.8 43.94,22.63 R9.1
RESET  (via drill 0.3)
  Top 0.254: v27.64,53.04 28.57,53.04 v33.6,48.01 | U1.3 10.08,52.2 11.61,53.72 22.31,53.72 23.1,52.94 v23.37,52.94 | RST.2 60.46,54.64 Q4.3 v57.56,54.64
  Top 0.406: U1.3 10.34,43.54 R16.1 C8.1 12.27,38.33 15.85,34.75 R34.1
  Bottom 0.254: v57.56,54.64 57.56,49.56 56.01,48.01 v33.6,48.01 | v27.64,53.04 23.47,53.04 v23.37,52.94
RST  (via drill 0.3)
  Top 0.254: v38.4,32.55 P2.5 18.33,32.55 R35.2 R34.2 R40.2
  Top 0.406: R44.1 C13.2 v38.4,17.2
  Bottom 0.254: v38.4,17.2 v38.4,32.55
RTS
  Top 0.254: Q4.2 R25.2 54.86,53.77 IC1.19
RXD/IO44  (via drill 0.3)
  Top 0.254: U1.36 12.62,58.1 15.11,55.6 v23.11,55.6 | v28.14,55.6 28.7,55.6 33.66,50.65 v34.06,50.65 | R29.1 57.13,59.52 v56.52,59.52
  Bottom 0.254: v23.11,55.6 v28.14,55.6 | v34.06,50.65 46.74,50.65 55.6,59.52 v56.52,59.52
TP_INT
  Top 0.254: P2.4 18.1,32.05 R38.2 R37.1 R36.1
TXD/IO43  (via drill 0.3)
  Top 0.254: U1.37 11.35,58.32 14.76,54.92 23.27,54.92 23.5,54.69 23.5,53.8 v23.37,53.67 | v27.13,53.67 28.93,53.67 34.49,48.11 51.66,48.11 52.48,48.92 R50.2 R30.1 | R30.1
  Bottom 0.254: v23.37,53.67 v27.13,53.67
USB_D+
  Top 0.254: USB-NATIVE.A6 62.03,76.89 62.26,77.12 62.26,77.6 61.98,77.88 61.06,77.88 USB-NATIVE.B6 57.52,77.89 R21.1
USB_D-
  Top 0.254: USB-NATIVE.B7 59.79,76.39 | USB-NATIVE.A7 60.17,77.39 59.82,77.04 59.82,76.74 | 59.82,76.74 59.82,76.42 59.79,76.39 | 59.82,76.74 59.49,76.41 60.15,76.41 59.82,76.74 | 59.79,76.39 57.54,76.39 R20.1
VBUS  (via drill 0.3)  (1 unrouted)
  Top 0.254: v59.11,63.66 | IC1.8 50.09,61.83 49.73,61.47 49.68,61.42
  Top 0.61: USB-TTL.VBUS1 v59.11,63.66 | USB-TTL.VBUS2 v59.11,68.56 58.09,68.56 C7.2 | R11.2 49.23,59.62 49.71,60.1 49.71,61.45 49.73,61.47
  Top 0.813: C6.2 R11.2 48.36,59.41 D2.+
  Bottom 0.254: 58.12,66.09 58.85,66.09 58.88,66.12
  Bottom 0.61: 59.16,65.05 58.12,66.09 59.05,67.03 | v49.51,59.9 49.57,59.96 49.57,61 49.71,61.14
  Bottom 0.813: v59.11,63.66 59.11,66.02 | 59.11,66.02 v59.11,68.56 | 58.88,66.12 59,66.12 59.11,66.02
  Bottom 1.016: 58.88,66.12 50.7,66.12 49.51,64.93 v49.51,59.9
VRTC
  Top 0.813: 46.79,102.87 46.79,107.27 47.7,108.18 U3.8 C14.2 | 46.79,102.87 R2.2 | R2.2 47.42,102.24 | 47.42,102.24 C25.2 48.46,100.72 D5.- | Q5.2 46.79,100.28 R2.2 | 46.79,102.87 47.42,102.24 | 47.42,102.24 47.42,100.13 48.51,100.13 48.51,102.26 48.18,102.26 48.01,102.09 48.01,100.51 47.98,100.49
XN  (via drill 0.3)
  Top 0.254: v29.97,24.95 31.04,24.95 31.29,24.69 U8.4 | P5.39 v16.97,72.3
  Bottom 0.254: v16.97,72.3 17.39,72.3 arc-90 17.58,72.11 17.58,26.29 18.92,24.95 v29.97,24.95
XP  (via drill 0.3)
  Top 0.254: U8.2 32.29,25.34 31.47,26.17 v31.09,26.17 | P5.37 18.42,73.3 17.87,73.85 v16.97,73.85
  Bottom 0.254: v16.97,73.85 17.87,73.85 arc-90 18.59,73.13 18.59,27 19.43,26.17 v31.09,26.17
YN  (via drill 0.3)
  Top 0.254: 30.79,23.98 U8.5 v29.83,23.97 v29.82,23.98 | P5.40 17.74,71.8 17.5,71.56 v16.97,71.56 v16.97,71.55
  Bottom 0.254: v16.97,71.55 16.97,26.04 19.02,23.98 v29.82,23.98
YP  (via drill 0.3)
  Top 0.254: U8.3 31.79,24.98 31.22,25.56 v30.58,25.56 | P5.38 17.75,72.8 17.5,73.05 v16.97,73.05
  Bottom 0.254: v16.97,73.05 17.56,73.05 arc-90 18.09,72.52 18.09,26.65 19.18,25.56 v30.58,25.56

### Text on the board
tPlace: IO18/SCL | IO17/SDA | +3V3 | GND | IO19/D- | IO20/D+ | +3V3 | GND | ESP32-S3 Parallel TFT | with Touch 4.3" V1.3 | www.makerfabs.com | - | +